# Altium schematic sheet main.SchDoc
size 297 x 209 mm
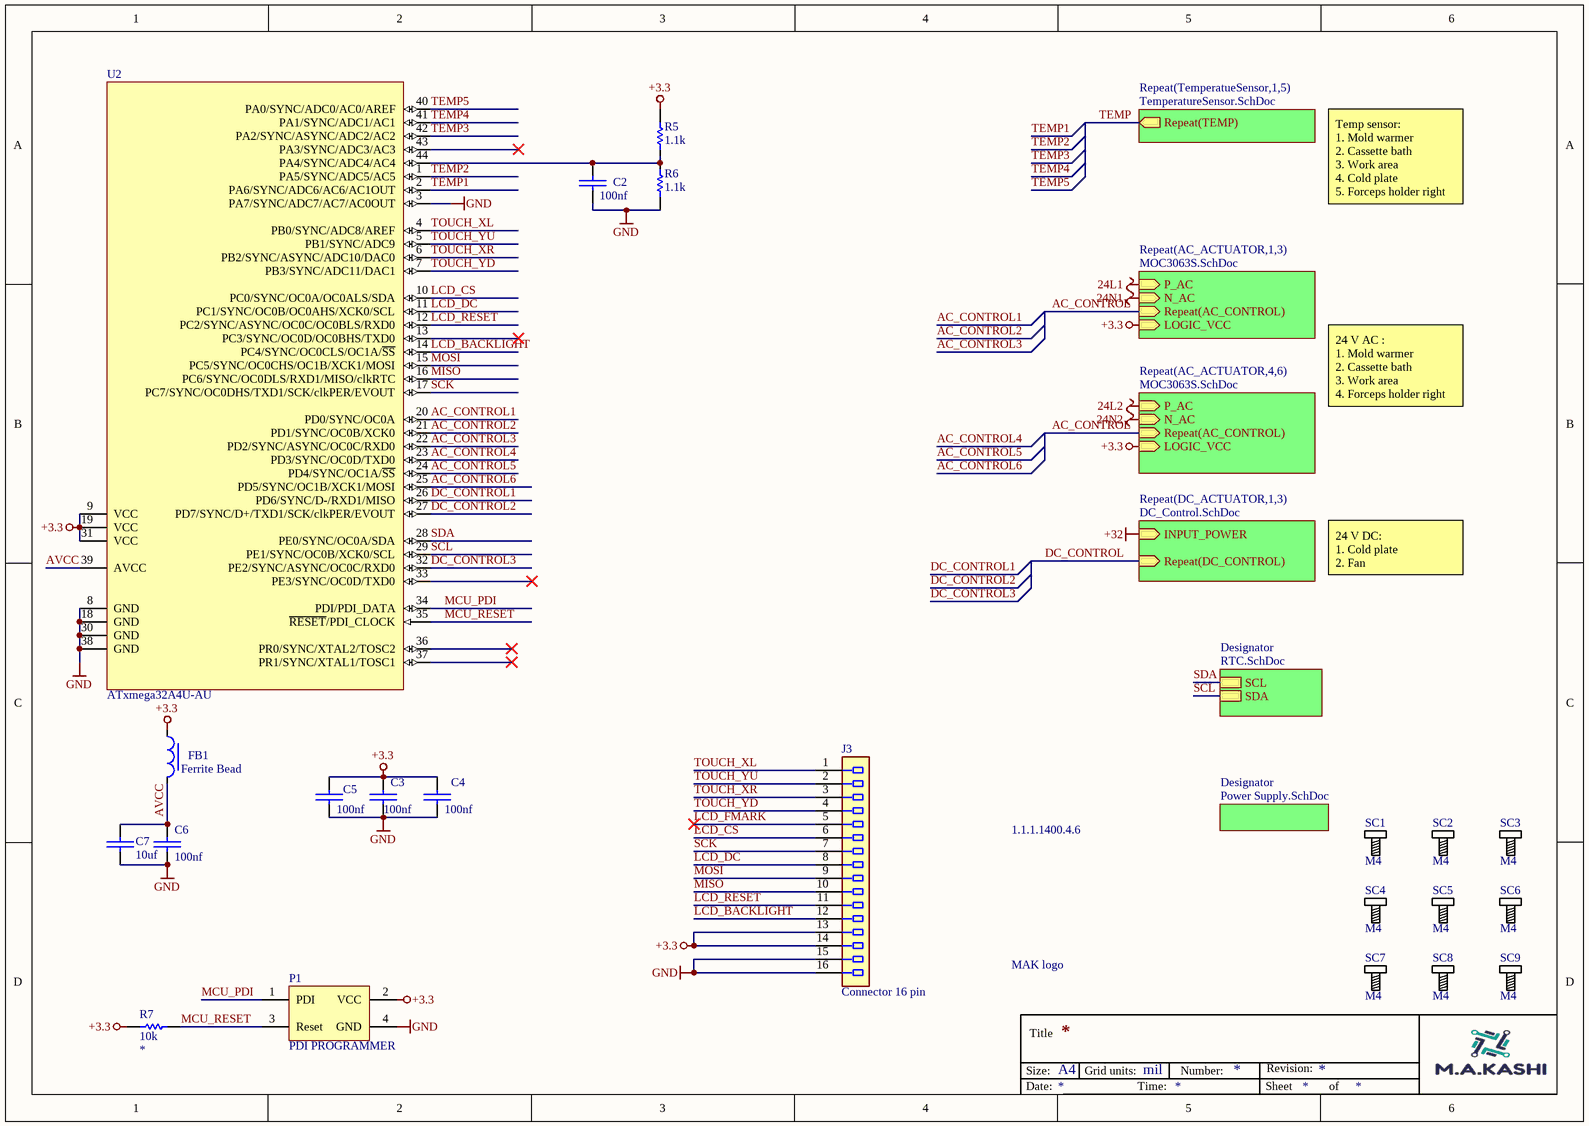
[diagram p0: main.SchDoc]

## Parts
1.1.1.1400.4.6  MAK logo  [MAk LOGO]
C2  100nf  [cap_0805_A]
C3  100nf  [cap_0805_A]
C4  100nf  [cap_0805_A]
C5  100nf  [cap_0805_A]
C6  100nf  [cap_0805_A]
C7  10uf  [cap_0805_A]
FB1  Ferrite Bead  [FER_0805_A]
J3  Connector 16 pin  [DS1013-16S - with Latch/Eject Levers]
P1  PDI PROGRAMMER  [PDI]  (no BOM)
R5  1.1k  [RES_0805_A]
R6  1.1k  [RES_0805_A]
R7  10k  [RES_0805_A]
SC1  M4  [SCREW_M4]
SC2  M4  [SCREW_M4]
SC3  M4  [SCREW_M4]
SC4  M4  [SCREW_M4]
SC5  M4  [SCREW_M4]
SC6  M4  [SCREW_M4]
SC7  M4  [SCREW_M4]
SC8  M4  [SCREW_M4]
SC9  M4  [SCREW_M4]
U2  ATxmega32A4U-AU  [44A_L]

## Sub-sheets
Designator = Power Supply.SchDoc: no entries
Designator = RTC.SchDoc: SCL, SDA
Repeat(AC_ACTUATOR,1,3) = MOC3063S.SchDoc: P_AC (in), N_AC (in), Repeat(AC_CONTROL) (in), LOGIC_VCC (in)
Repeat(AC_ACTUATOR,4,6) = MOC3063S.SchDoc: P_AC (in), N_AC (in), Repeat(AC_CONTROL) (in), LOGIC_VCC (in)
Repeat(DC_ACTUATOR,1,3) = DC_Control.SchDoc: Repeat(DC_CONTROL) (in), INPUT_POWER (in)
Repeat(TemperatueSensor,1,5) = TemperatureSensor.SchDoc: Repeat(TEMP) (out)

## Nets
24L1: sheet Repeat(AC_ACTUATOR,1,3)/P_AC
24L2: sheet Repeat(AC_ACTUATOR,4,6)/P_AC
24N1: sheet Repeat(AC_ACTUATOR,1,3)/N_AC
24N2: sheet Repeat(AC_ACTUATOR,4,6)/N_AC
+3.3: C3.1 C4.1 C5.1 FB1.1 J3.13 J3.14 P1.2(VCC) R5.2 R7.1 U2.9(VCC) U2.19(VCC) U2.31(VCC) ; sheet Repeat(AC_ACTUATOR,1,3)/LOGIC_VCC, sheet Repeat(AC_ACTUATOR,4,6)/LOGIC_VCC
+32: sheet Repeat(DC_ACTUATOR,1,3)/INPUT_POWER
GND: C2.2 C3.2 C4.2 C5.2 C6.2 C7.2 J3.15 J3.16 P1.4(GND) R6.1 U2.3(PA7/SYNC/ADC7/AC7/AC0OUT) U2.8(GND) U2.18(GND) U2.30(GND) U2.38(GND)
AC_CONTROL: sheet Repeat(AC_ACTUATOR,1,3)/Repeat(AC_CONTROL), sheet Repeat(AC_ACTUATOR,4,6)/Repeat(AC_CONTROL)
AC_CONTROL1: U2.20(PD0/SYNC/OC0A)
AC_CONTROL2: U2.21(PD1/SYNC/OC0B/XCK0)
AC_CONTROL3: U2.22(PD2/SYNC/ASYNC/OC0C/RXD0)
AC_CONTROL4: U2.23(PD3/SYNC/OC0D/TXD0)
AC_CONTROL5: U2.24(PD4/SYNC/OC1A/~{SS})
AC_CONTROL6: U2.25(PD5/SYNC/OC1B/XCK1/MOSI)
AVCC: C6.1 C7.1 FB1.2 U2.39(AVCC)
DC_CONTROL: sheet Repeat(DC_ACTUATOR,1,3)/Repeat(DC_CONTROL)
DC_CONTROL1: U2.26(PD6/SYNC/D-/RXD1/MISO)
DC_CONTROL2: U2.27(PD7/SYNC/D+/TXD1/SCK/clkPER/EVOUT)
DC_CONTROL3: U2.32(PE2/SYNC/ASYNC/OC0C/RXD0)
LCD_BACKLIGHT: J3.12 U2.14(PC4/SYNC/OC0CLS/OC1A/~{SS})
LCD_CS: J3.6 U2.10(PC0/SYNC/OC0A/OC0ALS/SDA)
LCD_DC: J3.8 U2.11(PC1/SYNC/OC0B/OC0AHS/XCK0/SCL)
LCD_FMARK: J3.5
LCD_RESET: J3.11 U2.12(PC2/SYNC/ASYNC/OC0C/OC0BLS/RXD0)
MCU_PDI: P1.1(PDI) U2.34(PDI/PDI_DATA)
MCU_RESET: P1.3(Reset) R7.2 U2.35(~{RESET}/PDI_CLOCK)
MISO: J3.10 U2.16(PC6/SYNC/OC0DLS/RXD1/MISO/clkRTC)
MOSI: J3.9 U2.15(PC5/SYNC/OC0CHS/OC1B/XCK1/MOSI)
SCK: J3.7 U2.17(PC7/SYNC/OC0DHS/TXD1/SCK/clkPER/EVOUT)
SCL: U2.29(PE1/SYNC/OC0B/XCK0/SCL) ; sheet Designator/SDA
SDA: U2.28(PE0/SYNC/OC0A/SDA) ; sheet Designator/SCL
TEMP: sheet Repeat(TemperatueSensor,1,5)/Repeat(TEMP)
TEMP1: U2.2(PA6/SYNC/ADC6/AC6/AC1OUT)
TEMP2: U2.1(PA5/SYNC/ADC5/AC5)
TEMP3: U2.42(PA2/SYNC/ASYNC/ADC2/AC2)
TEMP4: U2.41(PA1/SYNC/ADC1/AC1)
TEMP5: U2.40(PA0/SYNC/ADC0/AC0/AREF)
TOUCH_XL: J3.1 U2.4(PB0/SYNC/ADC8/AREF)
TOUCH_XR: J3.3 U2.6(PB2/SYNC/ASYNC/ADC10/DAC0)
TOUCH_YD: J3.4 U2.7(PB3/SYNC/ADC11/DAC1)
TOUCH_YU: J3.2 U2.5(PB1/SYNC/ADC9)
NetC2_1: C2.1 R5.1 R6.2 U2.44(PA4/SYNC/ADC4/AC4)

Not connected (* = marked no-connect by the designer): U2 13(PC3/SYNC/OC0D/OC0BHS/TXD0)* 33(PE3/SYNC/OC0D/TXD0)* 36(PR0/SYNC/XTAL2/TOSC2)* 37(PR1/SYNC/XTAL1/TOSC1)* 43(PA3/SYNC/ADC3/AC3)*

## Notes on the sheet
- Temp sensor:
  1. Mold warmer
  2. Cassette bath
  3. Work area
  4. Cold plate
  5. Forceps holder right
- 24 V AC :
  1. Mold warmer
  2. Cassette bath
  3. Work area
  4. Forceps holder right
- 24 V DC:
  1. Cold plate
  2. Fan
- Size:
- Title
- A4
- Grid units:
- mil
- Number:
- Revision:
- Date:
- Time:
- Sheet
- of

## Library data of the parts
C2-C7 = Capacitor: octopart or digikey description!; Part Number: *; Voltage Rating: *
  C2-C6: Capacitance: 100nf
  C7: Capacitance: 10uf
FB1 = Ferrite Bead: octopart or digikey description!
P1 = PDI PROGRAMMER: Header, 3-Pin, Dual row; LatestRevisionDate: 17-Jul-2002; LatestRevisionNote: Re-released for DXP Platform.; Publisher: Altium Limited
R5 R6 = Resistor: octopart or digikey description!; Part Number: RC0402JR-07100RL; Resistance: 1.1k; Voltage Rating: *; Power Rating: *; Tolerance: *
R7 = Resistor: octopart or digikey description!; Part Number: *; Resistance: 10k; Voltage Rating: *; Power Rating: *; Tolerance: *
SC1-SC9 = Screw_M4: Screw
U2 = ATxmega32A4U-AU: 8/16-bit AVR XMEGA A4U Microcontroller, 1.6-3.6V, 32MHz, 32K + 4KB Flash, 1K EEPROM, 4K SRAM, 44-pin TQFP, Industrial Grade (-40°C to 85°C); DatasheetVersion: revB, Dec-2011; PackageVersion: revC, Oct-2010; PackageReference: 44A; PackageDescription: 44-Pin Plastic Thin Profile Quad Flat Pack, 10 x 10 x 1.0 mm Body, 0.8 mm Pitch (TQFP); Code_JEDEC: MS-026-ACB; ComponentLink1Description: Manufacturer URL; ComponentLink1URL: http://www.atmel.com/; ComponentLink2Description: ATxmega16A4U/32A4U/64A4U/128A4U Datasheet; ComponentLink2URL: http://www.atmel.com/dyn/resources/prod_documents/doc8387.pdf
J3 = Connector 16 pin: System: Connector